# EAGLE design controller (EAGLE 7.6.0)

## Sheet 1 of 2: 5V Regulators
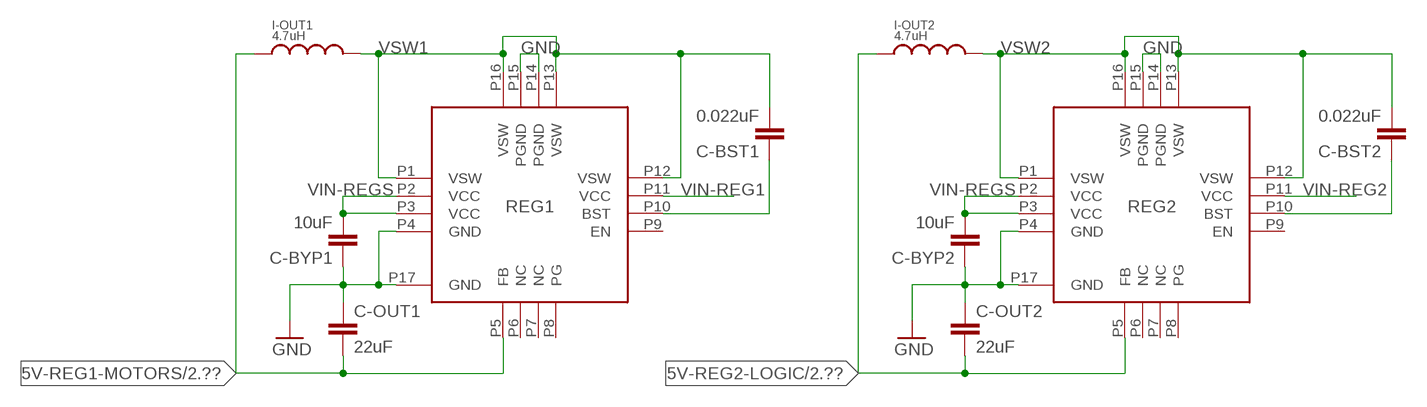
[diagram p0: schematic, sheet 1]

### Parts
C-BST1  0.022uF  C-EUC1608  [C1608]
C-BST2  0.022uF  C-EUC1608  [C1608]
C-BYP1  10uF  C-EUC3216  [C3216]
C-BYP2  10uF  C-EUC3216  [C3216]
C-OUT1  22uF  C-EUC2012  [C2012]
C-OUT2  22uF  C-EUC2012  [C2012]
I-OUT1  4.7uH  ASPI-0628-4R7M-T1  [ASPI-0628-4R7M-T1]
I-OUT2  4.7uH  ASPI-0628-4R7M-T1  [ASPI-0628-4R7M-T1]
REG1  TS30012-M050QFNR  [TS30012-M050QFNR]
REG2  TS30012-M050QFNR  [TS30012-M050QFNR]

### Nets
5V-REG1-MOTORS: C-OUT1.2 I-OUT1.P$1 REG1.P5(FB) ; also sheet 2
5V-REG2-LOGIC: C-OUT2.2 I-OUT2.P$1 REG2.P5(FB) ; also sheet 2
GND: C-BYP1.1 C-BYP2.1 C-OUT1.1 C-OUT2.1 REG1.P4(GND) REG1.P14(PGND) REG1.P15(PGND) REG1.P17(GND) REG2.P4(GND) REG2.P14(PGND) REG2.P15(PGND) REG2.P17(GND) ; also sheet 2
N$1: C-BST1.1 REG1.P10(BST)
N$2: C-BST2.1 REG2.P10(BST)
VIN-REG1: REG1.P11(VCC)
VIN-REG2: REG2.P11(VCC)
VIN-REGS: C-BYP1.2 C-BYP2.2 REG1.P2(VCC) REG1.P3(VCC) REG2.P2(VCC) REG2.P3(VCC) ; also sheet 2
VSW1: C-BST1.2 I-OUT1.P$2 REG1.P1(VSW) REG1.P12(VSW) REG1.P13(VSW) REG1.P16(VSW)
VSW2: C-BST2.2 I-OUT2.P$2 REG2.P1(VSW) REG2.P12(VSW) REG2.P13(VSW) REG2.P16(VSW)
Unconnected: REG1.P6(NC) REG1.P7(NC) REG1.P8(PG) REG1.P9(EN) REG2.P6(NC) REG2.P7(NC) REG2.P8(PG) REG2.P9(EN)

## Sheet 2 of 2: Main Schematic
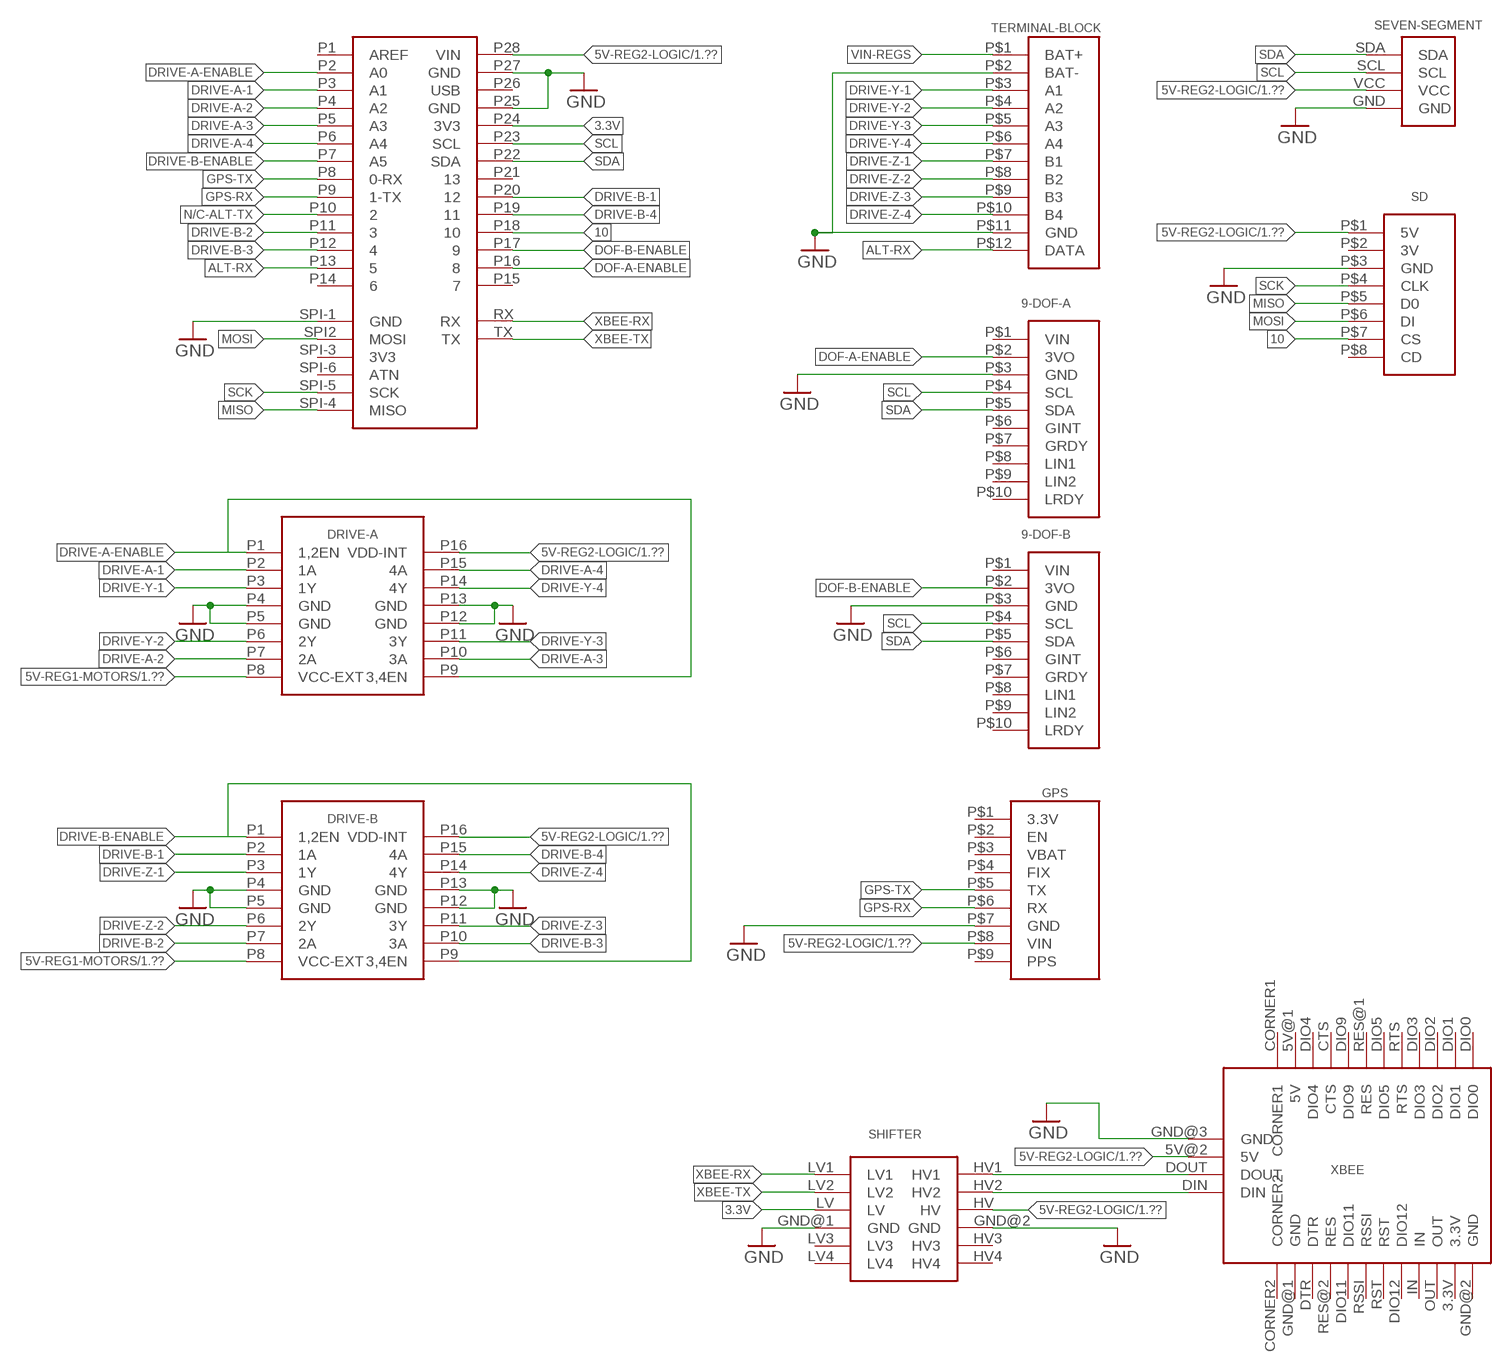
[diagram p1: schematic, sheet 2]

### Parts
9-DOF-A  ADAFRUIT-9-DOF  [ADAFRUIT-9-DOF]
9-DOF-B  ADAFRUIT-9-DOF  [ADAFRUIT-9-DOF]
DRIVE-A  SN754410  [SN754410]
DRIVE-B  SN754410  [SN754410]
GPS  ADAFRUIT-GPS-BREAKOUT  [ADAFRUIT-GPS-BREAKOUT]
NEUTRINO  NEUTRINO  [NEUTRINO]
SD  ADAFRUIT-MICRO-SD  [ADAFRUIT-MICRO-SD]
SEVEN-SEGMENT  ADAFRUIT-7-SEGMENT  [ADAFRUIT-7-SEGMENT]
SHIFTER  SPARKFUN-LEVEL-SHIFTER  [SPARKFUN-LEVEL-SHIFTER]
TERMINAL-BLOCK  1725753  [1725753]
XBEE  XBEE-BREAKOUT  [XBEE-BREAKOUT]

### Nets
3.3V: NEUTRINO.P24(3V3) SHIFTER.LV
5V-REG1-MOTORS: DRIVE-A.P8(VCC-EXT) DRIVE-B.P8(VCC-EXT) ; also sheet 1
5V-REG2-LOGIC: DRIVE-A.P16(VDD-INT) DRIVE-B.P16(VDD-INT) GPS.P$8(VIN) NEUTRINO.P28(VIN) SD.P$1(5V) SEVEN-SEGMENT.VCC SHIFTER.HV XBEE.5V@2(5V) ; also sheet 1
10: NEUTRINO.P18 SD.P$7(CS)
ALT-RX: NEUTRINO.P13 TERMINAL-BLOCK.P$12(DATA)
DOF-A-ENABLE: 9-DOF-A.P$2(3VO) NEUTRINO.P16
DOF-B-ENABLE: 9-DOF-B.P$2(3VO) NEUTRINO.P17
DRIVE-A-1: DRIVE-A.P2(1A) NEUTRINO.P3(A1)
DRIVE-A-2: DRIVE-A.P7(2A) NEUTRINO.P4(A2)
DRIVE-A-3: DRIVE-A.P10(3A) NEUTRINO.P5(A3)
DRIVE-A-4: DRIVE-A.P15(4A) NEUTRINO.P6(A4)
DRIVE-A-ENABLE: DRIVE-A.P1(1,2EN) DRIVE-A.P9(3,4EN) NEUTRINO.P2(A0)
DRIVE-B-1: DRIVE-B.P2(1A) NEUTRINO.P20
DRIVE-B-2: DRIVE-B.P7(2A) NEUTRINO.P11
DRIVE-B-3: DRIVE-B.P10(3A) NEUTRINO.P12
DRIVE-B-4: DRIVE-B.P15(4A) NEUTRINO.P19
DRIVE-B-ENABLE: DRIVE-B.P1(1,2EN) DRIVE-B.P9(3,4EN) NEUTRINO.P7(A5)
DRIVE-Y-1: DRIVE-A.P3(1Y) TERMINAL-BLOCK.P$3(A1)
DRIVE-Y-2: DRIVE-A.P6(2Y) TERMINAL-BLOCK.P$4(A2)
DRIVE-Y-3: DRIVE-A.P11(3Y) TERMINAL-BLOCK.P$5(A3)
DRIVE-Y-4: DRIVE-A.P14(4Y) TERMINAL-BLOCK.P$6(A4)
DRIVE-Z-1: DRIVE-B.P3(1Y) TERMINAL-BLOCK.P$7(B1)
DRIVE-Z-2: DRIVE-B.P6(2Y) TERMINAL-BLOCK.P$8(B2)
DRIVE-Z-3: DRIVE-B.P11(3Y) TERMINAL-BLOCK.P$9(B3)
DRIVE-Z-4: DRIVE-B.P14(4Y) TERMINAL-BLOCK.P$10(B4)
GND: 9-DOF-A.P$3(GND) 9-DOF-B.P$3(GND) DRIVE-A.P4(GND) DRIVE-A.P5(GND) DRIVE-A.P12(GND) DRIVE-A.P13(GND) DRIVE-B.P4(GND) DRIVE-B.P5(GND) DRIVE-B.P12(GND) DRIVE-B.P13(GND) GPS.P$7(GND) NEUTRINO.P25(GND) NEUTRINO.P27(GND) NEUTRINO.SPI-1(GND) SD.P$3(GND) SEVEN-SEGMENT.GND SHIFTER.GND@1(GND) SHIFTER.GND@2(GND) TERMINAL-BLOCK.P$2(BAT-) TERMINAL-BLOCK.P$11(GND) XBEE.GND@3(GND) ; also sheet 1
GPS-RX: GPS.P$6(RX) NEUTRINO.P9(1-TX)
GPS-TX: GPS.P$5(TX) NEUTRINO.P8(0-RX)
HV1: SHIFTER.HV1 XBEE.DOUT
HV2: SHIFTER.HV2 XBEE.DIN
MISO: NEUTRINO.SPI-4(MISO) SD.P$5(D0)
MOSI: NEUTRINO.SPI2(MOSI) SD.P$6(DI)
N/C-ALT-TX: NEUTRINO.P10
SCK: NEUTRINO.SPI-5(SCK) SD.P$4(CLK)
SCL: 9-DOF-A.P$4(SCL) 9-DOF-B.P$4(SCL) NEUTRINO.P23(SCL) SEVEN-SEGMENT.SCL
SDA: 9-DOF-A.P$5(SDA) 9-DOF-B.P$5(SDA) NEUTRINO.P22(SDA) SEVEN-SEGMENT.SDA
VIN-REGS: TERMINAL-BLOCK.P$1(BAT+) ; also sheet 1
XBEE-RX: NEUTRINO.RX SHIFTER.LV1
XBEE-TX: NEUTRINO.TX SHIFTER.LV2
Unconnected: 9-DOF-A.P$1(VIN) 9-DOF-A.P$6(GINT) 9-DOF-A.P$7(GRDY) 9-DOF-A.P$8(LIN1) 9-DOF-A.P$9(LIN2) 9-DOF-A.P$10(LRDY) 9-DOF-B.P$1(VIN) 9-DOF-B.P$6(GINT) 9-DOF-B.P$7(GRDY) 9-DOF-B.P$8(LIN1) 9-DOF-B.P$9(LIN2) 9-DOF-B.P$10(LRDY) GPS.P$1(3.3V) GPS.P$2(EN) GPS.P$3(VBAT) GPS.P$4(FIX) GPS.P$9(PPS) NEUTRINO.P1(AREF) NEUTRINO.P14 NEUTRINO.P15 NEUTRINO.P21 NEUTRINO.P26(USB) NEUTRINO.SPI-3(3V3) NEUTRINO.SPI-6(ATN) SD.P$2(3V) SD.P$8(CD) SHIFTER.HV3 SHIFTER.HV4 SHIFTER.LV3 SHIFTER.LV4 XBEE.3.3V XBEE.5V@1(5V) XBEE.CORNER1 XBEE.CORNER2 XBEE.CTS XBEE.DIO0 XBEE.DIO1 XBEE.DIO2 XBEE.DIO3 XBEE.DIO4 XBEE.DIO5 XBEE.DIO9 XBEE.DIO11 XBEE.DIO12 XBEE.DTR XBEE.GND@1(GND) XBEE.GND@2(GND) XBEE.IN XBEE.OUT XBEE.RES@1(RES) XBEE.RES@2(RES) XBEE.RSSI XBEE.RST XBEE.RTS

## Library data of the parts
9-DOF-A 9-DOF-B = RocketControlBoard:ADAFRUIT-9-DOF: Gyroscope + Accelerometer / Compass; MANF: Adafruit; URL: https://www.adafruit.com/products/1714
C-BST1 C-BST2 = resistor:C-EU: CAPACITOR, European symbol; DESC: CAP CER 0.022UF 50V X7R 0603; DIGIKEY#: 1276-1104-1-ND; MANF: Samsung Electro-Mechanics America, Inc.; MANF#: CL10B223KB8NNNC
C-BYP1 C-BYP2 = resistor:C-EU: CAPACITOR, European symbol; DESC: CAP CER 10UF 35V X5R 1206; DIGIKEY#: 490-5524-1-ND; MANF: Murata Electronics North America; MANF#: GRM31CR6YA106KA12L
C-OUT1 C-OUT2 = resistor:C-EU: CAPACITOR, European symbol; DESC: CAP CER 22UF 10V X5R 0805; DIGIKEY#: 445-7664-1-ND; MANF: TDK Corporation; MANF#: C2012X5R1A226K125AB
DRIVE-A DRIVE-B = RocketControlBoard:SN754410: IC HALF-H DRVR QUAD 16-DIP; DESC: IC HALF-H DRVR QUAD 16-DIP; DIGIKEY#: 296-9911-5-ND; MANF: Texas Instruments; MANF#: SN754410NE
GPS = RocketControlBoard:ADAFRUIT-GPS-BREAKOUT
I-OUT1 I-OUT2 = RocketControlBoard:ASPI-0628-4R7M-T1: FIXED IND 4.7UH 3A 31 MOHM SMD; DESC: FIXED IND 4.7UH 3A 31 MOHM SMD; DIGIKEY#: 535-12806-1-ND; MANF: Abracon LLC; MANF#: ASPI-0628-4R7M-T1
NEUTRINO = RocketControlBoard:NEUTRINO
REG1 REG2 = RocketControlBoard:TS30012-M050QFNR: IC REG BUCK 5V 2A SYNC 16-VQFN; DESC: IC REG BUCK 5V 2A SYNC 16-VQFN; DIGIKEY#: TS30012-M050QFNRCT-ND; MANF: Semtech Corporation; MANF#: TS30012-M050QFNR
SD = RocketControlBoard:ADAFRUIT-MICRO-SD
SEVEN-SEGMENT = RocketControlBoard:ADAFRUIT-7-SEGMENT
SHIFTER = RocketControlBoard:SPARKFUN-LEVEL-SHIFTER
TERMINAL-BLOCK = RocketControlBoard:1725753: CONN TERM BLOCK 2.54MM 12POS; DESC: CONN TERM BLOCK 2.54MM 12POS; DIGIKEY#: 277-1283-ND; MANF: Phoenix Contact; MANF#: 1725753
XBEE = RocketControlBoard:XBEE-BREAKOUT

## Net classes
0 default: clearance 0.205 mm

## Board
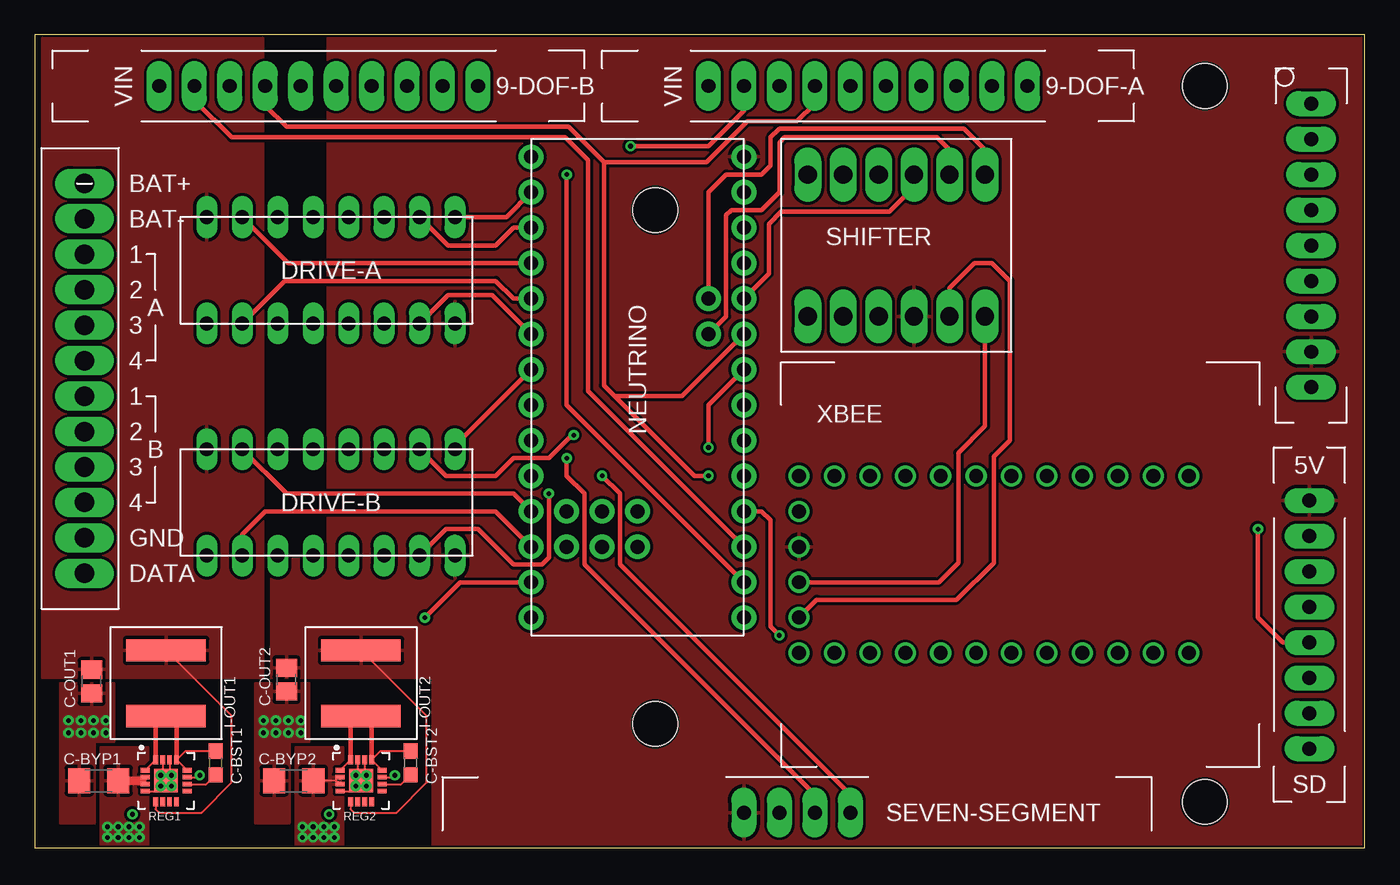
[diagram p2: board, top side]
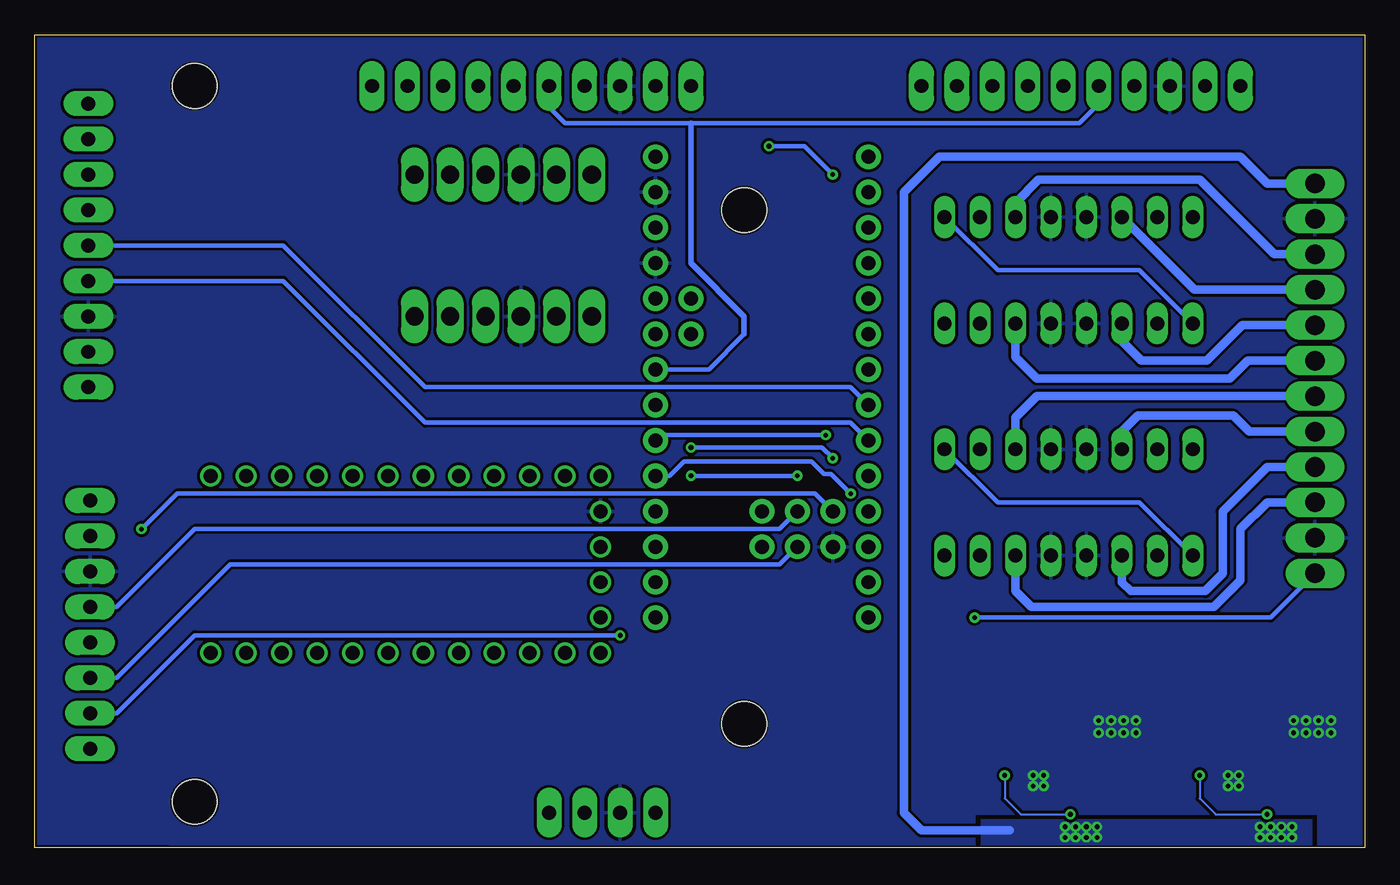
[diagram p3: board, bottom side, seen from below]

Size 95.27 x 58.27 mm. Coordinates in mm from the lower left corner, seen from the top.
Outline: 0,0 95.27,0 95.27,58.27 0,58.27 0,0
Copper layers (1*16): Top 0.035mm / dielectric 1.5mm / Bottom 0.035mm
Design rules "pcbway *": minimum track width 6mil, minimum drill 12mil, track to track 6mil, track to pad 6mil, pad to pad 6mil, via to via 6mil, smd to smd 6mil, copper to edge 6mil, drill to drill 6mil, minimum pad ring 10mil, minimum via ring 8mil, stop-mask expansion 4mil, vias tented up to drill 15mil, thermal gap 10mil
Holes 3.2 mm at 44.45,45.72 44.45,8.89 83.82,54.61 83.82,3.3

### Footprints (pad centres in the part's own frame; a part is rotated, then mirrored left to right if it is on the bottom)
ADAFRUIT-9-DOF = drill 1 pad 1.778 long: P$1 0,11.43; P$2 0,8.89; P$3 0,6.35; P$4 0,3.81; P$5 0,1.27; P$6 0,-1.27; P$7 0,-3.81; P$8 0,-6.35; P$9 0,-8.89; P$10 0,-11.43
C1608 = smd 1.1 x 1: 1 -0.85,0; 2 0.85,0
C3216 = smd 1.6 x 1.8: 1 -1.4,0; 2 1.4,0
C2012 = smd 1.3 x 1.5: 1 -0.85,0; 2 0.85,0
SN754410 = drill 1 long: P1 -2.54,0; P2 -2.54,-2.54; P3 -2.54,-5.08; P4 -2.54,-7.62; P5 -2.54,-10.16; P6 -2.54,-12.7; P7 -2.54,-15.24; P8 -2.54,-17.78; P9 5.08,-17.78; P10 5.08,-15.24; P11 5.08,-12.7; P12 5.08,-10.16; P13 5.08,-7.62; P14 5.08,-5.08; P15 5.08,-2.54; P16 5.08,0
ADAFRUIT-GPS-BREAKOUT = drill 1 pad 1.778 long: P$1 0,10.16; P$2 0,7.62; P$3 0,5.08; P$4 0,2.54; P$5 0,0; P$6 0,-2.54; P$7 0,-5.08; P$8 0,-7.62; P$9 0,-10.16
ASPI-0628-4R7M-T1 = smd 1.6 x 5.7: P$1 -2.35,0; P$2 2.35,0
NEUTRINO = drill 1 pad 1.778: P1 0,0; P2 0,-2.54; P3 0,-5.08; P4 0,-7.62; P5 0,-10.16; P6 0,-12.7; P7 0,-15.24; P8 0,-17.78; P9 0,-20.32; P10 0,-22.86; P11 0,-25.4; P12 0,-27.94; P13 0,-30.48; P14 0,-33.02; P15 15.24,-33.02; P16 15.24,-30.48; P17 15.24,-27.94; P18 15.24,-25.4; P19 15.24,-22.86; P20 15.24,-20.32; P21 15.24,-17.78; P22 15.24,-15.24; P23 15.24,-12.7; P24 15.24,-10.16; P25 15.24,-7.62; P26 15.24,-5.08; P27 15.24,-2.54; P28 15.24,0; RX 12.7,-10.16; SPI2 5.08,-27.94; SPI-1 2.54,-27.94; SPI-3 7.62,-27.94; SPI-4 2.54,-25.4; SPI-5 5.08,-25.4; SPI-6 7.62,-25.4; TX 12.7,-12.7
TS30012-M050QFNR = smd 0.65 x 0.34: P1 -1.5,0.75; P2 -1.5,0.25; P3 -1.5,-0.25; P4 -1.5,-0.75; P9 1.5,-0.75; P10 1.5,-0.25; P11 1.5,0.25; P12 1.5,0.75 | smd 0.34 x 0.65: P5 -0.75,-1.5; P6 -0.25,-1.5; P7 0.25,-1.5; P8 0.75,-1.5; P13 0.75,1.5; P14 0.25,1.5; P15 -0.25,1.5; P16 -0.75,1.5 | smd 1.7 x 1.7: P17 0,0
ADAFRUIT-MICRO-SD = drill 1 pad 1.778 long: P$1 0,8.89; P$2 0,6.35; P$3 0,3.81; P$4 0,1.27; P$5 0,-1.27; P$6 0,-3.81; P$7 0,-6.35; P$8 0,-8.89
ADAFRUIT-7-SEGMENT = drill 1 pad 1.778 long: GND 0,-1.27; SCL 0,3.81; SDA 0,1.27; VCC 0,-3.81
SPARKFUN-LEVEL-SHIFTER = drill 1.3 long: GND@1 0,-1.27; GND@2 10.16,-1.27; HV 10.16,1.27; HV1 10.16,6.35; HV2 10.16,3.81; HV3 10.16,-3.81; HV4 10.16,-6.35; LV 0,1.27; LV1 0,6.35; LV2 0,3.81; LV3 0,-3.81; LV4 0,-6.35
1725753 = drill 1.4 pad 1.778 long: P$1 0,0; P$2 0,-2.54; P$3 0,-5.08; P$4 0,-7.62; P$5 0,-10.16; P$6 0,-12.7; P$7 0,-15.24; P$8 0,-17.78; P$9 0,-20.32; P$10 0,-22.86; P$11 0,-25.4; P$12 0,-27.94
XBEE-BREAKOUT = drill 1: 3.3V 25.4,-6.35; 5V@1 2.54,6.35; 5V@2 0,1.27; CORNER1 0,6.35; CORNER2 0,-6.35; CTS 7.62,6.35; DIN 0,-3.81; DIO0 27.94,6.35; DIO1 25.4,6.35; DIO2 22.86,6.35; DIO3 20.32,6.35; DIO4 5.08,6.35; DIO5 15.24,6.35; DIO9 10.16,6.35; DIO11 10.16,-6.35; DIO12 17.78,-6.35; DOUT 0,-1.27; DTR 5.08,-6.35; GND@1 2.54,-6.35; GND@2 27.94,-6.35; GND@3 0,3.81; IN 20.32,-6.35; OUT 22.86,-6.35; RES@1 12.7,6.35; RES@2 7.62,-6.35; RSSI 12.7,-6.35; RST 15.24,-6.35; RTS 17.78,6.35

### Placement (x,y rotation side)
9-DOF-A  59.69,54.61 90 top
9-DOF-B  20.32,54.61 90 top
C-BST1  12.95,6.1 90 top
C-BST2  26.92,6.1 90 top
C-BYP1  4.57,4.83 0 top
C-BYP2  18.54,4.83 0 top
C-OUT1  4.06,11.94 90 top
C-OUT2  18.03,12.07 90 top
DRIVE-A  30.1,42.67 270 top
DRIVE-B  30.1,26.04 270 top
GPS  91.44,43.18 0 top
I-OUT1  9.4,11.81 270 top
I-OUT2  23.37,11.81 270 top
NEUTRINO  35.56,49.53 0 top
REG1  9.4,4.83 0 top
REG2  23.37,4.83 0 top
SD  91.31,16 0 top
SEVEN-SEGMENT  54.61,2.54 270 top
SHIFTER  61.72,48.26 270 top
TERMINAL-BLOCK  3.56,47.62 0 top
XBEE  54.74,20.32 0 top

### Tracks (layer width: path | path; a pad name or v marks a point on that pad's centre or on a via)
3.3V
  Top 0.305: NEUTRINO.P24 52.58,41.15 52.58,44.7 53.47,45.59 61.21,45.59 62.99,47.37 SHIFTER.LV
5V-REG1-MOTORS
  Top 0.152: REG1.P5 8.65,2.78 8.89,2.54 11.94,2.54 14.1,4.7 14.1,9.46 I-OUT1.P$1
  pour Top: 0.51,12.19 16.38,12.19 16.38,58.04 0.51,58.04
5V-REG2-LOGIC
  Top 0.152: REG2.P5 22.62,2.78 22.86,2.54 25.91,2.54 28.07,4.7 28.07,9.46 I-OUT2.P$1 23.37,13.91
  pour Top: 16.89,12.19 28.45,12.19 28.45,0 95.25,0 95.25,58.04 20.96,58.04 20.96,20.7 16.89,20.7
10  (via drill 0.33)
  Top 0.305: NEUTRINO.P18 52.07,24.13 52.7,23.5 52.7,15.88 v53.34,15.24
  Bottom 0.305: SD.P$7 89.41,9.65 83.82,15.24 v53.34,15.24
ALT-RX  (via drill 0.33)
  Top 0.305: v27.94,16.51 30.48,19.05 NEUTRINO.P13
  Bottom 0.305: TERMINAL-BLOCK.P$12 6.73,16.51 v27.94,16.51
DOF-A-ENABLE  (via drill 0.33)
  Top 0.305: 9-DOF-A.P$2 50.8,52.83 48.26,50.29 v42.67,50.29 | NEUTRINO.P16 38.1,31.75 v38.1,48.26
  Bottom 0.305: v38.1,48.26 40.13,50.29 v42.67,50.29
DOF-B-ENABLE
  Top 0.305: 9-DOF-B.P$2 11.43,53.59 14.1,50.93 37.97,50.93 39.62,49.28 39.62,32.77 NEUTRINO.P17
DRIVE-A-1
  Top 0.305: DRIVE-A.P2 29.59,43.18 33.02,43.18 34.29,44.45 NEUTRINO.P3
DRIVE-A-2
  Top 0.305: DRIVE-A.P7 18.16,41.91 NEUTRINO.P4
DRIVE-A-3
  Top 0.305: DRIVE-A.P10 17.91,40.64 33.02,40.64 34.29,39.37 NEUTRINO.P5
DRIVE-A-4
  Top 0.305: DRIVE-A.P15 29.59,39.62 32.77,39.62 NEUTRINO.P6
DRIVE-A-ENABLE
  Top 0.305: DRIVE-A.P1 33.78,45.21 NEUTRINO.P2
  Bottom 0.305: DRIVE-A.P9 16.13,41.4 26.29,41.4 DRIVE-A.P1
DRIVE-B-1  (via drill 0.33)
  Top 0.305: DRIVE-B.P2 29.46,26.67 33.02,26.67 34.29,27.94 36.83,27.94 38.48,29.59 v38.61,29.59
  Bottom 0.305: v38.61,29.59 50.42,29.59 NEUTRINO.P20
DRIVE-B-2
  Top 0.305: DRIVE-B.P7 18.03,25.4 34.29,25.4 NEUTRINO.P11
DRIVE-B-3
  Top 0.305: DRIVE-B.P10 14.86,22.48 16.51,24.13 33.02,24.13 NEUTRINO.P12
DRIVE-B-4  (via drill 0.33)
  Top 0.305: DRIVE-B.P15 29.46,22.86 31.75,22.86 34.29,20.32 36.32,20.32 36.83,20.83 v36.83,25.4
  Bottom 0.305: v36.83,25.4 38.23,26.8 38.73,26.8 39.62,27.69 48.77,27.69 49.78,26.67 NEUTRINO.P19
DRIVE-B-ENABLE
  Top 0.305: DRIVE-B.P1 30.1,28.83 NEUTRINO.P7
  Bottom 0.305: DRIVE-B.P1 26.29,24.77 16.13,24.77 DRIVE-B.P9
DRIVE-Y-1
  Bottom 0.61: TERMINAL-BLOCK.P$3 6.48,42.55 11.81,47.88 23.37,47.88 25.02,46.23 DRIVE-A.P3
DRIVE-Y-2
  Bottom 0.61: DRIVE-A.P6 12.19,40.01 TERMINAL-BLOCK.P$4
DRIVE-Y-3
  Bottom 0.61: TERMINAL-BLOCK.P$5 8.76,37.47 11.3,34.93 16,34.93 17.4,36.32 DRIVE-A.P11
DRIVE-Y-4
  Bottom 0.61: TERMINAL-BLOCK.P$6 8.38,34.93 9.65,33.66 23.5,33.66 25.02,35.18 DRIVE-A.P14
DRIVE-Z-1
  Bottom 0.61: TERMINAL-BLOCK.P$7 23.5,32.38 25.02,30.86 DRIVE-B.P3
DRIVE-Z-2
  Bottom 0.61: DRIVE-B.P6 17.4,29.84 16.26,30.99 9.4,30.99 8.25,29.84 TERMINAL-BLOCK.P$8
DRIVE-Z-3
  Bottom 0.61: TERMINAL-BLOCK.P$9 6.99,27.3 10.16,24.13 10.16,19.69 11.43,18.41 16.76,18.41 17.4,19.05 DRIVE-B.P11
DRIVE-Z-4
  Bottom 0.61: TERMINAL-BLOCK.P$10 6.99,24.77 8.89,22.86 8.89,19.18 10.8,17.27 23.88,17.27 25.02,18.41 DRIVE-B.P14
GND  (via drill 0.33)
  Top 0.152: REG1.P15 9.15,5.08 REG1.P17 | REG1.P14 9.65,5.08 REG1.P17 | v9.78,5.21 REG1.P17 | REG1.P4 8.65,4.08 v9.02,4.45 | REG2.P15 23.12,5.34 v22.99,5.21 | REG2.P14 23.62,5.34 v23.75,5.21 REG2.P17 | REG2.P4 22.62,4.08 v22.99,4.45
  other vias: 9.02,5.21 9.78,4.45 2.41,9.14 3.3,9.14 4.19,9.14 5.08,9.14 5.08,8.25 4.19,8.25 3.3,8.25 2.41,8.25 23.75,4.45 16.38,9.14 17.27,9.14 18.16,9.14 19.05,9.14 19.05,8.25 18.16,8.25 17.27,8.25 16.38,8.25
  pour Bottom: 0.25,0 3.3,0 3.3,2.41 27.94,2.41 27.94,0 95.25,0.25 95.25,58.04 0.25,58.04
  pour Top: 1.78,1.78 4.32,1.78 4.32,7.62 5.72,7.62 5.72,11.81 1.78,11.81
  pour Top: 15.75,1.78 18.29,1.78 18.29,7.62 19.69,7.62 19.69,11.81 15.75,11.81
GPS-RX
  Bottom 0.305: NEUTRINO.P9 36.83,30.48 67.31,30.48 77.47,40.64 GPS.P$6
GPS-TX
  Bottom 0.305: NEUTRINO.P8 36.83,33.02 67.31,33.02 77.47,43.18 GPS.P$5
HV1
  Top 0.305: SHIFTER.HV1 68.07,30.23 66.17,28.32 66.17,20.45 64.77,19.05 XBEE.DOUT
HV2
  Top 0.305: XBEE.DIN 56.01,17.78 66.04,17.78 68.71,20.45 68.71,28.07 69.85,29.21 69.85,40.64 68.58,41.91 67.31,41.91 65.53,40.13 SHIFTER.HV2
MISO  (via drill 0.33)
  Top 0.305: SD.P$5 89.41,14.73 87.63,16.51 v87.63,22.86
  Bottom 0.305: NEUTRINO.SPI-4 39.37,25.4 85.09,25.4 v87.63,22.86
MOSI
  Bottom 0.305: NEUTRINO.SPI2 41.91,20.32 81.28,20.32 89.41,12.19 SD.P$6
N$1
  Top 0.152: REG1.P10 12.28,4.58 C-BST1.1
N$2
  Top 0.152: REG2.P10 26.25,4.58 C-BST2.1
SCK
  Bottom 0.305: NEUTRINO.SPI-5 41.91,22.86 83.82,22.86 89.41,17.27 SD.P$4
SCL  (via drill 0.33)
  Top 0.305: 9-DOF-B.P$4 16.51,53.21 18.03,51.69 38.23,51.69 40.77,49.15 | 40.77,49.15 40.77,33.15 41.53,32.38 | 41.53,32.38 46.36,32.38 NEUTRINO.P23 | 40.77,49.15 48.13,49.15 51.05,52.07 54.61,52.07 55.88,53.34 9-DOF-A.P$4 | SEVEN-SEGMENT.SCL 58.42,3.81 41.91,20.32 41.91,25.4 v40.64,26.67 | v48.26,26.67 47.24,26.67 41.53,32.38
  Bottom 0.305: v40.64,26.67 v48.26,26.67
SDA  (via drill 0.33)
  Top 0.305: SEVEN-SEGMENT.SDA 55.88,3.81 39.37,20.32 39.37,25.4 38.1,26.67 v38.1,27.94 | v48.26,28.7 48.26,31.75 NEUTRINO.P22
  Bottom 0.305: 9-DOF-B.P$5 19.05,53.34 20.45,51.94 48.26,51.94 57.28,51.94 58.42,53.09 9-DOF-A.P$5 | NEUTRINO.P22 46.99,34.29 44.45,36.83 | v38.1,27.94 38.86,28.7 v48.26,28.7
  Bottom 0.406: 44.45,36.83 44.45,38.1 48.26,41.91 48.26,51.94
VIN-REG1  (via drill 0.33)
  Top 0.152: REG1.P11 11.68,5.08 v11.81,5.21
  Bottom 0.152: v11.81,5.21 11.81,3.56 10.67,2.41 v6.99,2.41
VIN-REG2  (via drill 0.33)
  Top 0.152: REG2.P11 25.65,5.08 v25.78,5.21
  Bottom 0.152: v25.78,5.21 25.78,3.56 24.64,2.41 v21.08,2.41
VIN-REGS  (via drill 0.33)
  Top 0.152: REG1.P3 7.65,4.83 | REG2.P3 21.62,4.83 C-BYP2.2
  Top 0.61: 7.65,4.83 C-BYP1.2
  Bottom 0.61: TERMINAL-BLOCK.P$1 6.99,47.62 8.89,49.53 30.48,49.53 33.02,46.99 33.02,2.54 31.75,1.27 25.4,1.27
  other vias: 7.49,1.52 7.49,0.76 19.18,1.52 19.94,1.52 20.7,1.52 21.46,1.52 21.46,0.76 20.7,0.76 19.94,0.76 19.18,0.76 6.73,1.52 6.73,0.76 5.97,1.52 5.97,0.76 5.21,1.52 5.21,0.76
  pour Bottom: 3.81,0 27.43,0 27.43,2.03 3.81,2.03
  pour Top: 4.7,0 4.7,7.24 8.13,7.24 8.13,0
  pour Top: 18.67,0 18.67,7.24 22.1,7.24 22.1,0
VSW1
  Top 0.152: REG1.P1 REG1.P16 | REG1.P12 REG1.P13 10.77,6.95 C-BST1.2
  Top 0.305: REG1.P16 8.65,8.71 I-OUT1.P$2 10.15,8.71 REG1.P13
VSW2
  Top 0.152: REG2.P16 REG2.P1 | REG2.P12 REG2.P13 24.74,6.95 C-BST2.2
  Top 0.305: REG2.P16 22.62,8.96 I-OUT2.P$2 24.12,9.46 REG2.P13
XBEE-RX
  Top 0.305: NEUTRINO.RX 48.26,46.99 49.53,48.26 52.07,48.26 52.7,48.9 52.7,50.93 53.34,51.56 66.55,51.56 68.07,50.04 SHIFTER.LV1
XBEE-TX
  Top 0.305: NEUTRINO.TX 49.53,38.1 49.53,45.34 49.91,45.72 52.07,45.72 53.34,46.99 53.34,50.55 53.72,50.93 64.64,50.93 65.53,50.04 SHIFTER.LV2